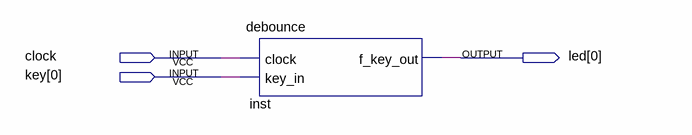
[diagram p0: schematic sheet]
// Quartus schematic tste_debounce.bdf as structural Verilog: 1 symbols, 3 pins
module tste_debounce (
  input  clock,
  input  [0:0] key,
  output [0:0] led
);

  debounce inst (.clock(clock), .key_in(key[0]), .f_key_out(led[0]));
endmodule
